# Altium schematic sheet Output.SchDoc
size A; SheetNumber: 5; SheetTotal: 8
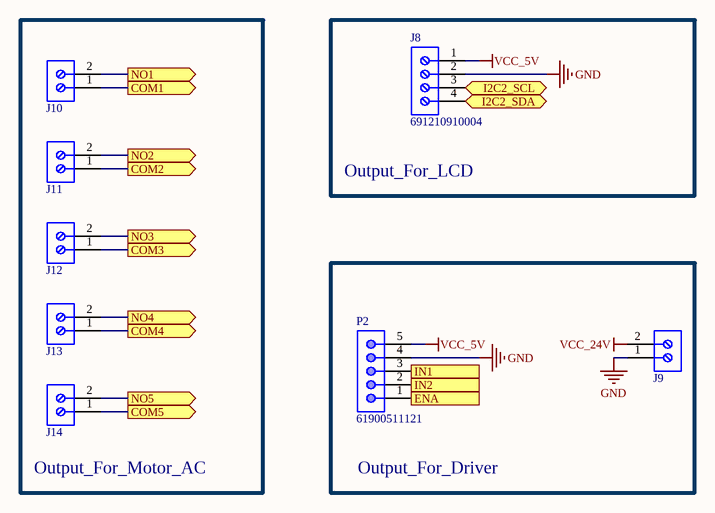
[diagram p0: Output.SchDoc]

## Parts
J8  691210910004  [691210910004]
J9  691137710002  [691137710002]  (value not drawn)
J10  691137710002  [691137710002]  (value not drawn)
J11  691137710002  [691137710002]  (value not drawn)
J12  691137710002  [691137710002]  (value not drawn)
J13  691137710002  [691137710002]  (value not drawn)
J14  691137710002  [691137710002]  (value not drawn)
P2  61900511121  [61900511121]

## Blocks framed on the sheet
Output_For_Motor_AC: J10-J14
Output_For_LCD: J8
Output_For_Driver: J9 P2

## Ports
COM1 (out), COM2 (out), COM3 (out), COM4 (out), COM5 (out), ENA (in), I2C2_SCL (bidir), I2C2_SDA (bidir), IN1 (in), IN2 (in), NO1 (out), NO2 (out), NO3 (out), NO4 (out), NO5 (out)

## Nets
GND: J8.2 J9.1 P2.4
VCC_5V: J8.1 P2.5
VCC_24V: J9.2
COM1: J10.1 ; port COM1
COM2: J11.1 ; port COM2
COM3: J12.1 ; port COM3
COM4: J13.1 ; port COM4
COM5: J14.1 ; port COM5
ENA: P2.1 ; port ENA
I2C2_SCL: J8.3 ; port I2C2_SCL
I2C2_SDA: J8.4 ; port I2C2_SDA
IN1: P2.3 ; port IN1
IN2: P2.2 ; port IN2
NO1: J10.2 ; port NO1
NO2: J11.2 ; port NO2
NO3: J12.2 ; port NO3
NO4: J13.2 ; port NO4
NO5: J14.2 ; port NO5

## Library data of the parts
J8 = 691210910004: WR-TBL Serie 2109 Horizontal Entry, Rising Cage Clamp, pitch 2.54mm, 4p; Compliance: Lead free / RoHS; Modularity: No; PCB/Cable/Panel: PCB; Pin Number: 4; Rated Current [UL]: 6A; Working Voltage [UL]: 150VAC; No. Pad (SMD): 0; ComponentLink1Description: Manufacturer; ComponentLink1URL: http://www.we-online.de; ComponentLink2URL: https://katalog.we-online.de/em/datasheet/691210910004.pdf; ComponentLink2Description: Datasheet; Mounting Technology: THT; Part Number: 691210910004; Packaging: Box; Operating Temperature: -40 to +105degC; Pitch: 2.54mm; Published Date: October 2019; Type: Horizontal; Publisher: Wurth Elektronik; Application: Rising Cage Clamp; No. Pad (THT): 4; Unit Price (Digikey): 1.96
J9-J14 = 691137710002: WR-TBL Series 1377 Horizontal Entry, Through Hole, pitch 5mm, 2p; Manufacturer: Wurth Elektronik; Pin Number: 2; Rated Current: 16A; Working Voltage: 300V; PCB/Cable/Panel: PCB; Modularity: No; No. Pad (SMD): 0; ComponentLink1Description: Manufacturer Link; ComponentLink1URL: https://www.we-online.com/redexpert/article/691137710002?ad; ComponentLink2Description: Datasheet; ComponentLink2URL: https://www.we-online.com/redexpert/spec/691137710002?ad; Category: Terminal Blocks; Match Code: WR-TBL; Manufacturer Part Number: 691137710002; Mount: Through Hole; Operating Temperature Max: 120°C; Operating Temperature Min: -30°C; Packaging: Box; Pitch: 5mm; Orientation: Horizontal; Application: Pressure Clamp; No. Pad (THT): 2; Unit Price (Digikey): 0.41
P2 = 61900511121: WR-WTB THT Male Vertical Locking Header, pitch 2.54mm, 5p; Pin Number: 5; Contact Resistance: 20mOhm; Rated Current: 3A; Withstanding Voltage: 1000VAC; Working Voltage: 250VAC; No. Pad (SMD): 0; ComponentLink1Description: Manufacturer; ComponentLink1URL: http://www.we-online.de; ComponentLink2Description: Datasheet; ComponentLink2URL: https://www.we-online.com/catalog/datasheet/61900511121.pdf; Pitch: 2.54mm; Published Date: January 2020; Publisher: Wurth Elektronik; Mounting Technology: THT; Packaging: Bag; Operating Temperature: -40 to +105degC; Part Number: 61900511121; Gender: Male; Type: Vertical; No. Pad (THT): 5; Unit Price (Digikey): 1.22